# EasyEDA Pro project MSDRv2.eprj, schematic Schematic1
Board Name: Board1; Create Date: 2024-11-10; Page Name: P1; Project Name: MSDRv2; Schematic Name: Schematic1; Update Date: 2024-11-09; Company: EasyEDA.com; Drawn: EasyEDA; Page Size: A4; Part Number: JLCPCB-002; Reviewed: EasyEDA; Version: V0.1
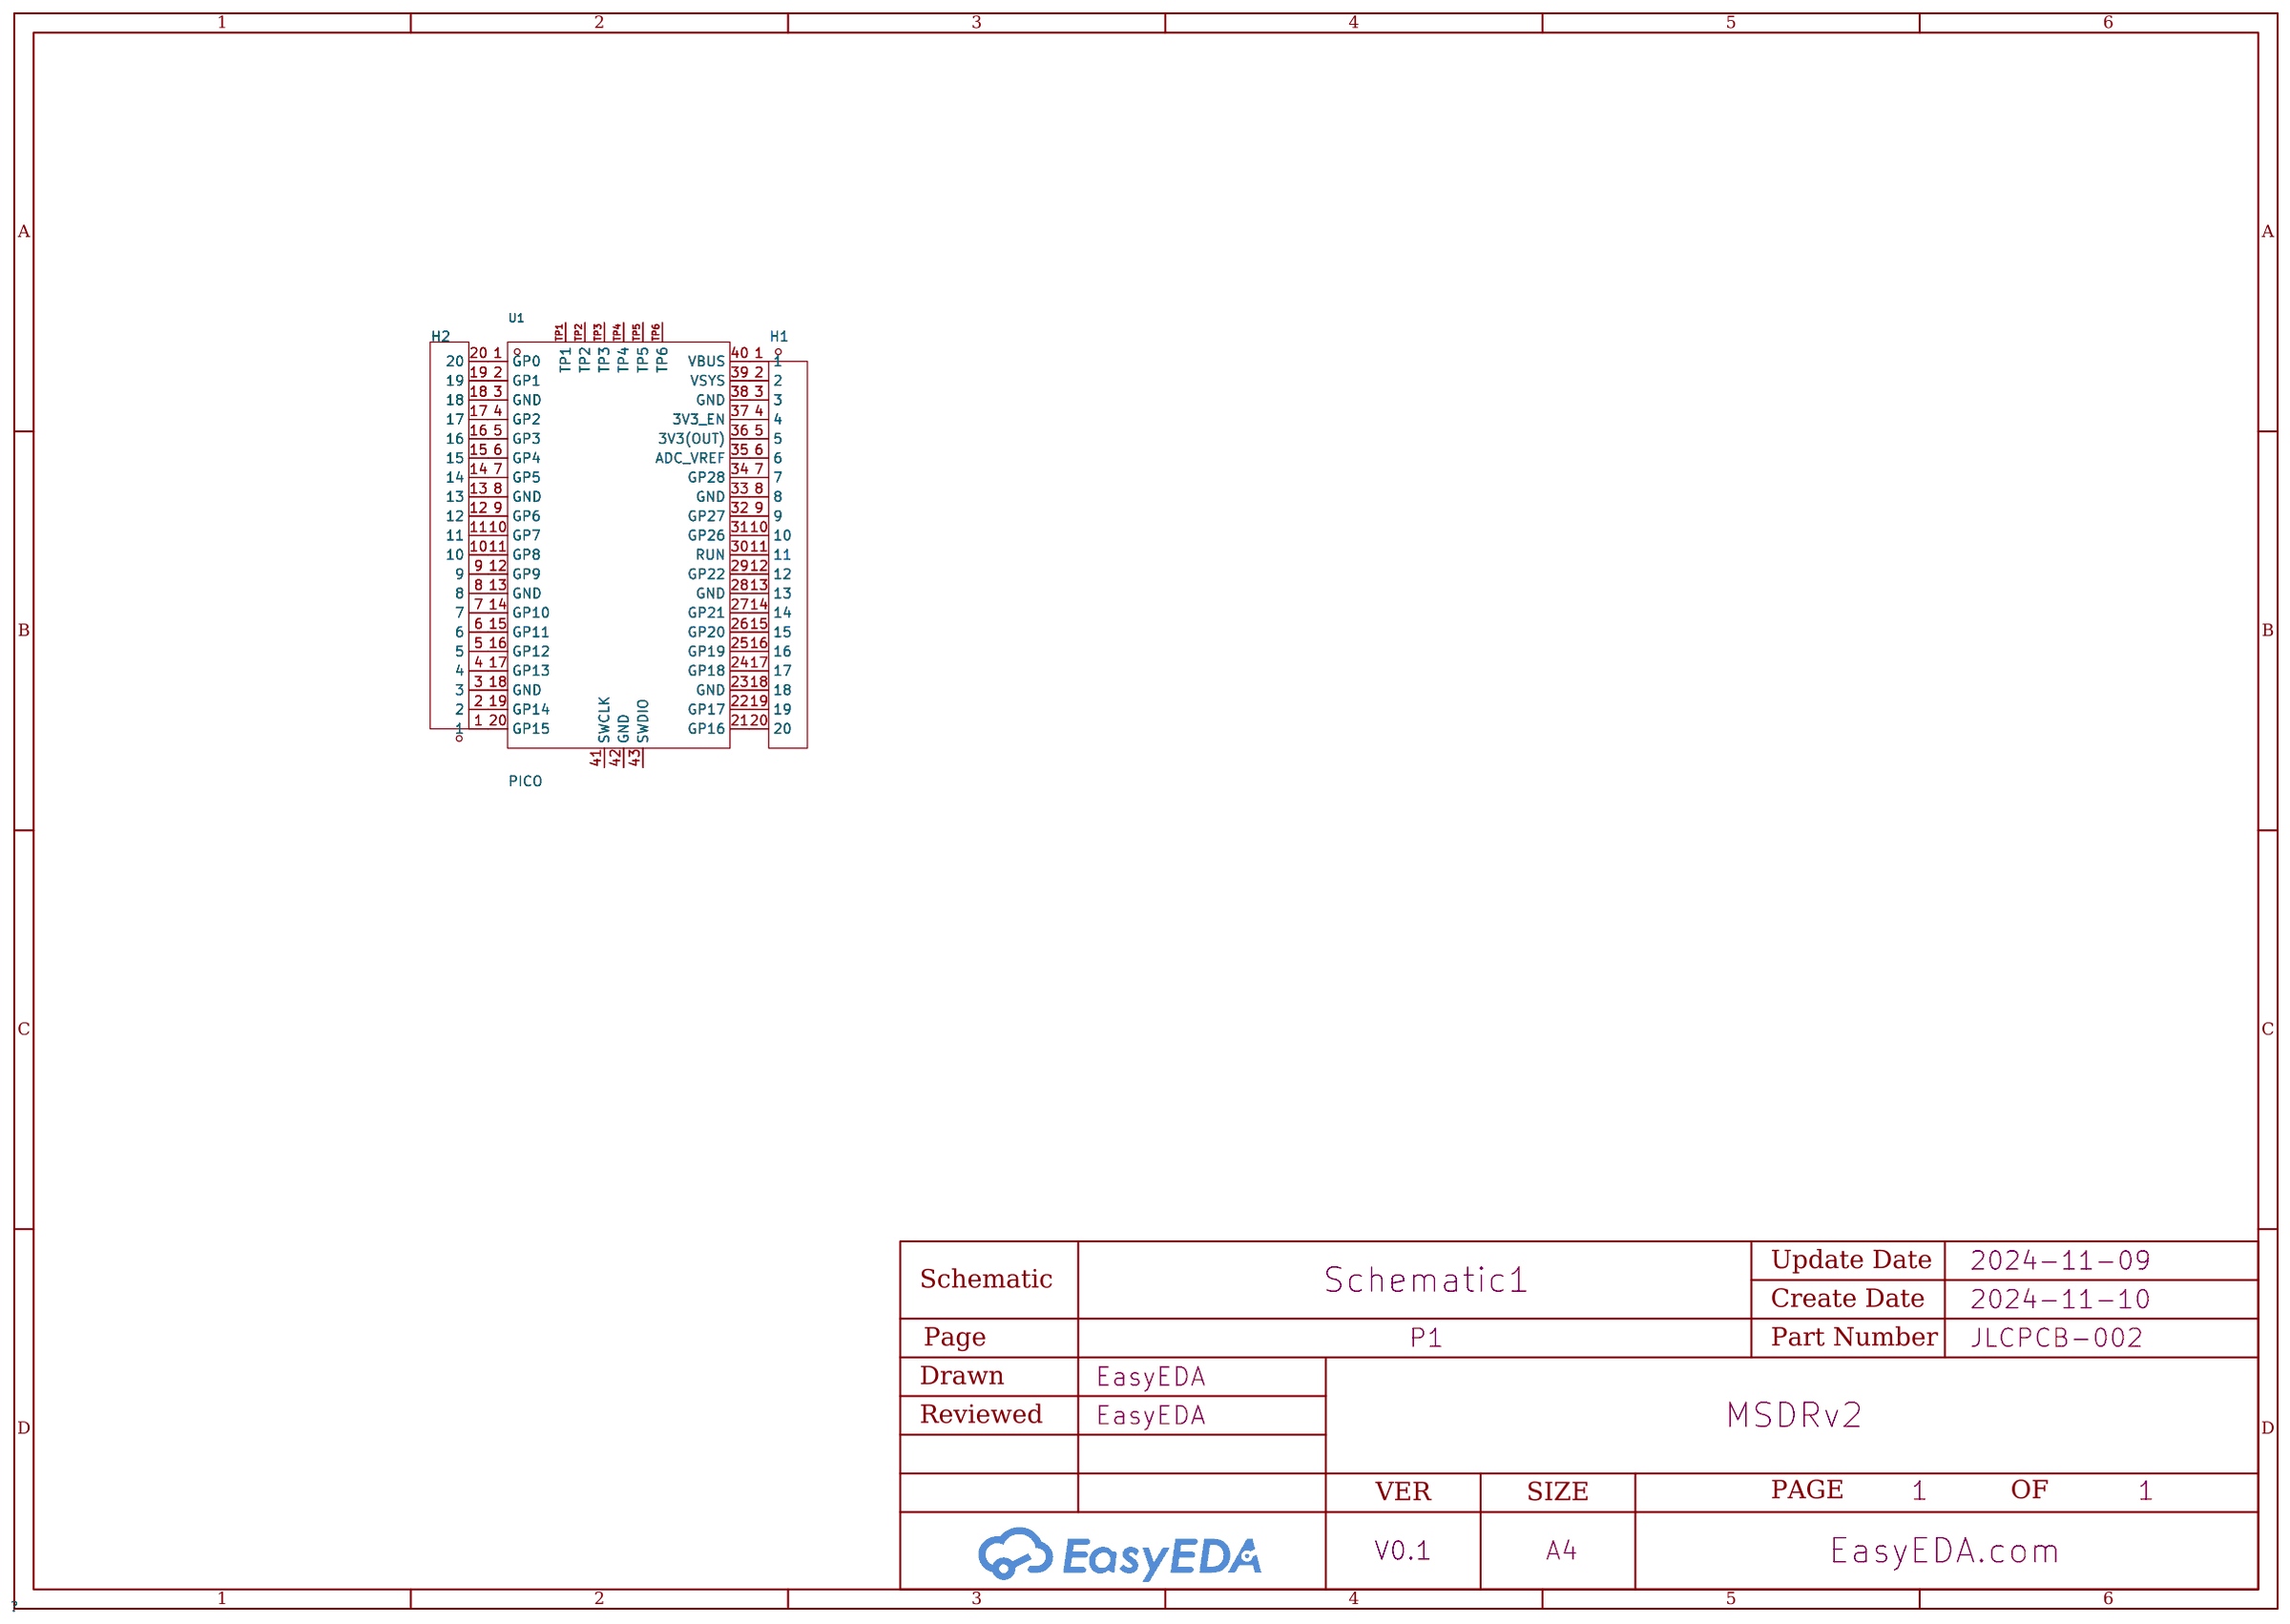
[diagram p0: schematic sheet]

## Parts
CBB1  -
H1  -  [HDR-TH_20P-P2.54-V-M-1]
H2  -  [HDR-TH_20P-P2.54-V-M-1]
U1  PICO  [COMM-SMD_L51.0-W21.0-P2.54_SC0916]

## Library data of the parts
H1 H2 = HDR-M_2.54_1x20P: Supplier Footprint: Through
U1 = PICO: Supplier Part: C7203002; Manufacturer: Raspberry Pi(树莓派); JLCPCB Part Class: Extended Part; Datasheet: https://atta.szlcsc.com/upload/public/pdf/source/20230906/086376002DDC9866828648BC93E51F8B.pdf; Supplier: LCSC

## Nets
$1N285: H1.20 U1.21(GP16)
$1N287: H1.19 U1.22(GP17)
$1N289: H1.18 U1.23(GND)
$1N291: H1.17 U1.24(GP18)
$1N293: H1.16 U1.25(GP19)
$1N295: H1.15 U1.26(GP20)
$1N297: H1.14 U1.27(GP21)
$1N299: H1.13 U1.28(GND)
$1N301: H1.12 U1.29(GP22)
$1N303: H1.11 U1.30(RUN)
$1N305: H1.10 U1.31(GP26)
$1N307: H1.9 U1.32(GP27)
$1N309: H1.8 U1.33(GND)
$1N311: H1.7 U1.34(GP28)
$1N313: H1.6 U1.35(ADC_VREF)
$1N315: H1.5 U1.36(3V3(OUT))
$1N317: H1.4 U1.37(3V3_EN)
$1N319: H1.3 U1.38(GND)
$1N321: H1.2 U1.39(VSYS)
$1N323: H1.1 U1.40(VBUS)
$1N402: H2.20 U1.1(GP0)
$1N404: H2.19 U1.2(GP1)
$1N406: H2.18 U1.3(GND)
$1N408: H2.17 U1.4(GP2)
$1N410: H2.16 U1.5(GP3)
$1N412: H2.15 U1.6(GP4)
$1N414: H2.14 U1.7(GP5)
$1N416: H2.13 U1.8(GND)
$1N418: H2.12 U1.9(GP6)
$1N420: H2.11 U1.10(GP7)
$1N422: H2.10 U1.11(GP8)
$1N424: H2.9 U1.12(GP9)
$1N426: H2.8 U1.13(GND)
$1N428: H2.7 U1.14(GP10)
$1N430: H2.6 U1.15(GP11)
$1N432: H2.5 U1.16(GP12)
$1N434: H2.4 U1.17(GP13)
$1N436: H2.3 U1.18(GND)
$1N438: H2.2 U1.19(GP14)
$1N440: H2.1 U1.20(GP15)

Not connected (* = marked no-connect by the designer): CBB1 (TXQN); U1 41(SWCLK) 42(GND) 43(SWDIO) TP1 TP2 TP3 TP4 TP5 TP6
